# EAGLE design Relay_Controller_V1_0 (EAGLE 9.6.2)
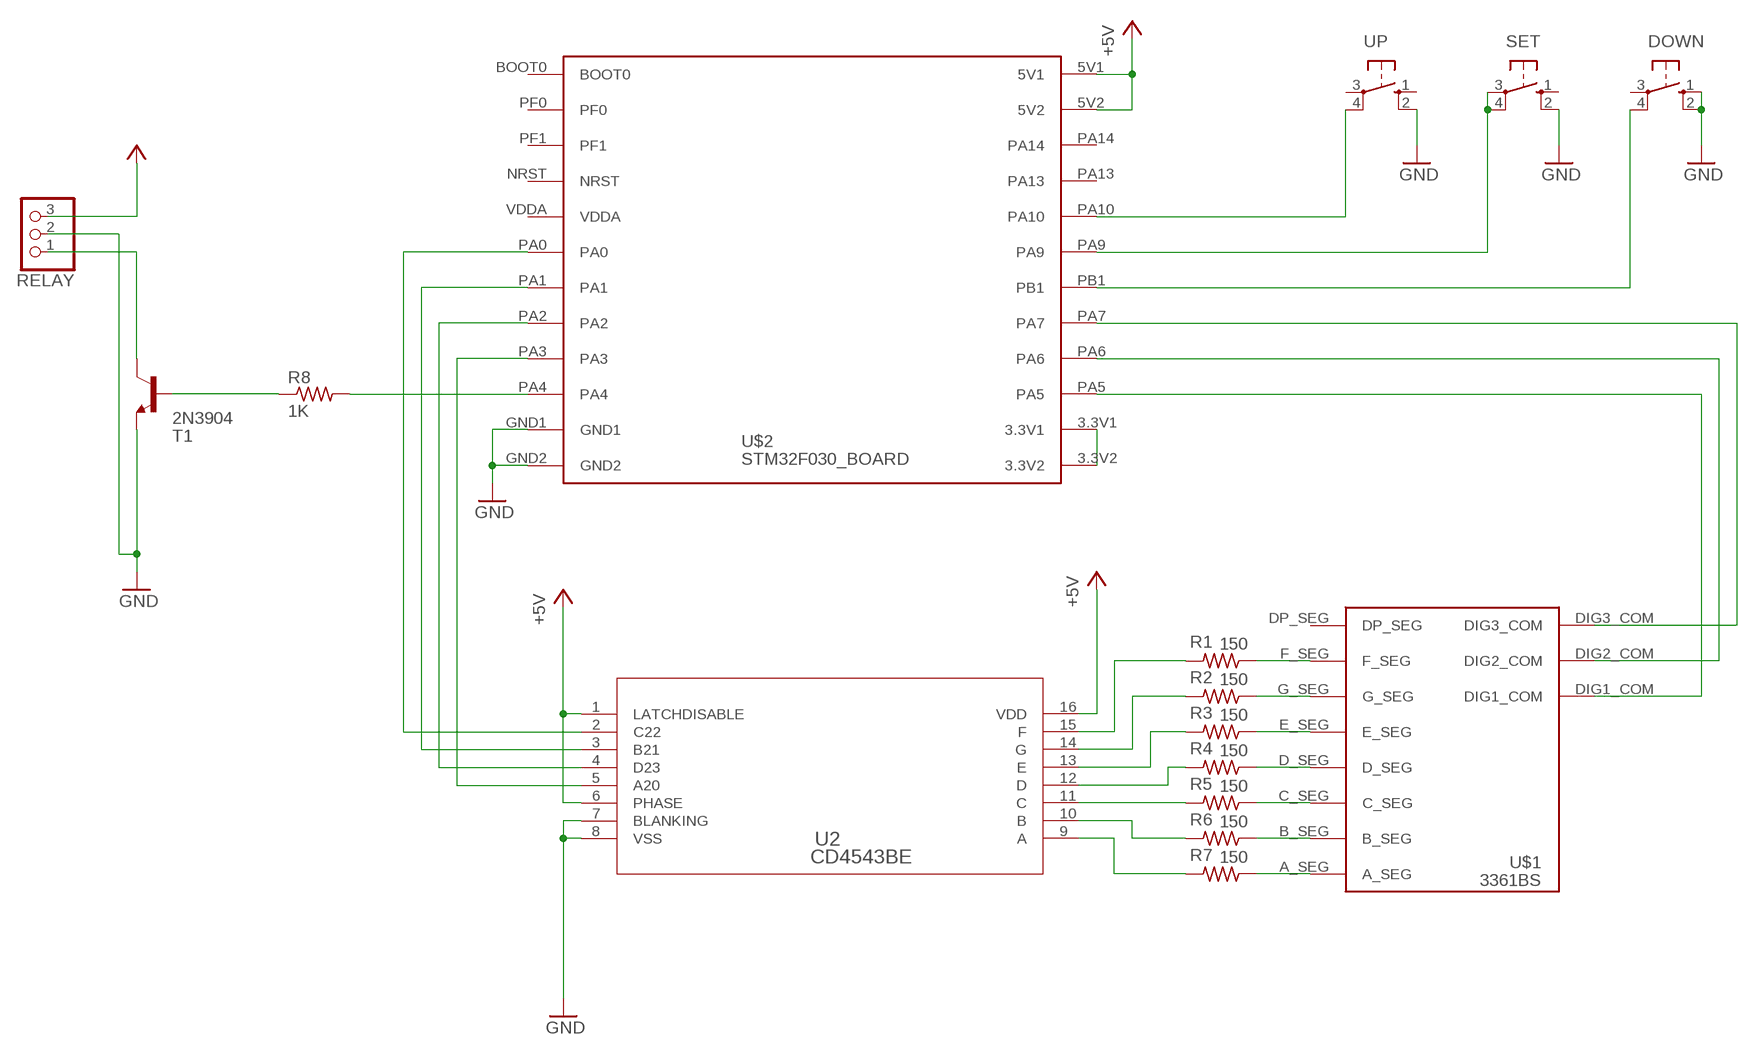
[diagram p0: schematic, sheet 1]

## Parts
DOWN  10-XX  [B3F-10XX]
R1  150  R-US_0207/7  [0207/7]
R2  150  R-US_0207/7  [0207/7]
R3  150  R-US_0207/7  [0207/7]
R4  150  R-US_0207/7  [0207/7]
R5  150  R-US_0207/7  [0207/7]
R6  150  R-US_0207/7  [0207/7]
R7  150  R-US_0207/7  [0207/7]
R8  1K  R-US_0207/7  [0207/7]
RELAY  PINHD-1X3  [1X03]
SET  10-XX  [B3F-10XX]
T1  2N3904  [TO92]
U2  CD4543BE  [N16]
U$1  3361BS  [3361BS]
U$2  STM32F030_BOARD  [STM32F030F4P6_BOARD]
UP  10-XX  [B3F-10XX]

## Nets
+5V: RELAY.3 U2.1(LATCHDISABLE) U2.6(PHASE) U2.16(VDD) U$2.5V1 U$2.5V2
GND: DOWN.1(S) DOWN.2(S1) RELAY.2 SET.2(S1) T1.3(E) U2.7(BLANKING) U2.8(VSS) U$2.GND1 U$2.GND2 UP.2(S1)
N$1: R1.1 U$1.F_SEG
N$2: R2.1 U$1.G_SEG
N$3: R3.1 U$1.E_SEG
N$4: R4.1 U$1.D_SEG
N$5: R5.1 U$1.C_SEG
N$6: R6.1 U$1.B_SEG
N$7: R7.1 U$1.A_SEG
N$8: R7.2 U2.9(A)
N$9: R6.2 U2.10(B)
N$10: R5.2 U2.11(C)
N$11: R1.2 U2.15(F)
N$12: R2.2 U2.14(G)
N$13: R3.2 U2.13(E)
N$14: R4.2 U2.12(D)
N$15: U2.2(C22) U$2.PA0
N$16: U2.3(B21) U$2.PA1
N$17: U2.4(D23) U$2.PA2
N$18: U2.5(A20) U$2.PA3
N$19: U$1.DIG1_COM U$2.PA5
N$20: U$1.DIG2_COM U$2.PA6
N$21: U$1.DIG3_COM U$2.PA7
N$22: U$2.3.3V1 U$2.3.3V2
N$23: DOWN.4(P1) U$2.PB1
N$24: R8.2 U$2.PA4
N$25: U$2.PA10 UP.4(P1)
N$26: RELAY.1 T1.1(C)
N$28: SET.3(P) SET.4(P1) U$2.PA9
N$29: R8.1 T1.2(B)
Unconnected: DOWN.3(P) SET.1(S) U$1.DP_SEG U$2.BOOT0 U$2.NRST U$2.PA13 U$2.PA14 U$2.PF0 U$2.PF1 U$2.VDDA UP.1(S) UP.3(P)

## Library data of the parts
DOWN SET UP = switch-omron:10-XX: OMRON SWITCH; MPN: B3F-1000; OC_FARNELL: 176432; OC_NEWARK: 36M3542
R1-R8 = rcl:R-US_: RESISTOR, American symbol; SPICEPREFIX: R
RELAY = pinhead:PINHD-1X3: PIN HEADER
T1 = transistor:2N3904: NPN TRANSISTOR
U2 = CD4543B_Seq:CD4543BE; DATASHEET_URL: http://www.ti.com/lit/gpn/CD4543B; DESCRIPTION: CMOS BCD-to-Seven-Segment Latch/Decoder/Driver for Liquid-Crystal Displays; FAMILY_NAME: DECODER/DEMULTIPLEXER; GENERIC_PART_NUMBER: CD4543B; INDUSTRY_STD_PKG_TYPE: PDIP; MANUFACTURER: Texas Instruments; PACKAGE_DESIGNATOR: N; PIN_COUNT: 16
U$1 = 3361BS:3361BS
U$2 = STM32F030_Board:STM32F030_BOARD

## Board
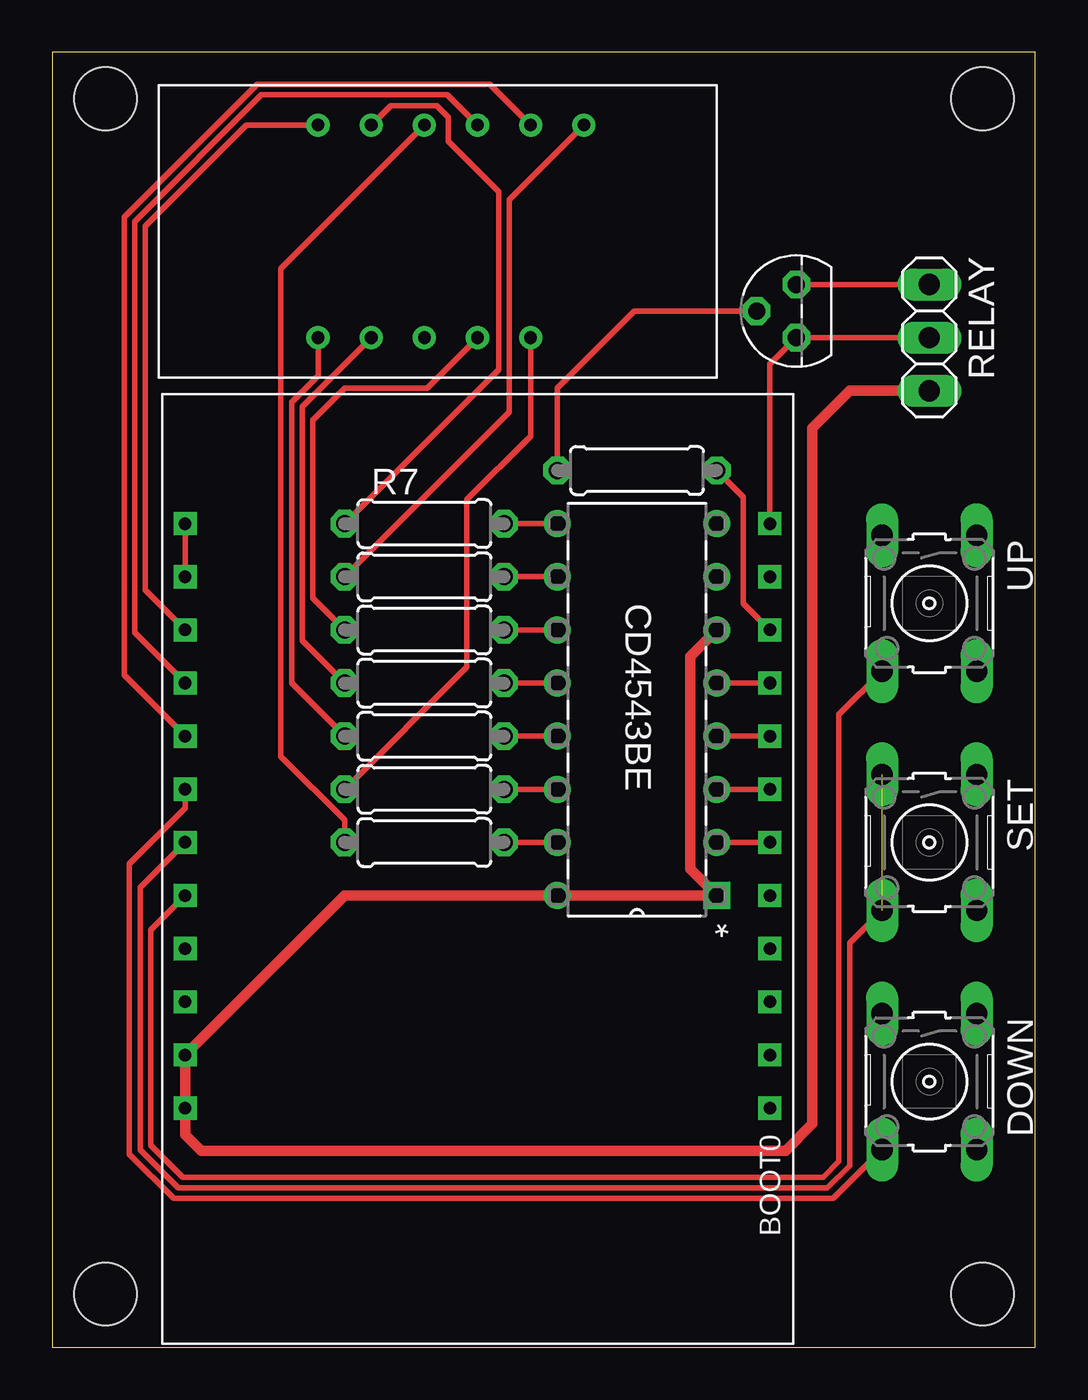
[diagram p1: board, top side]
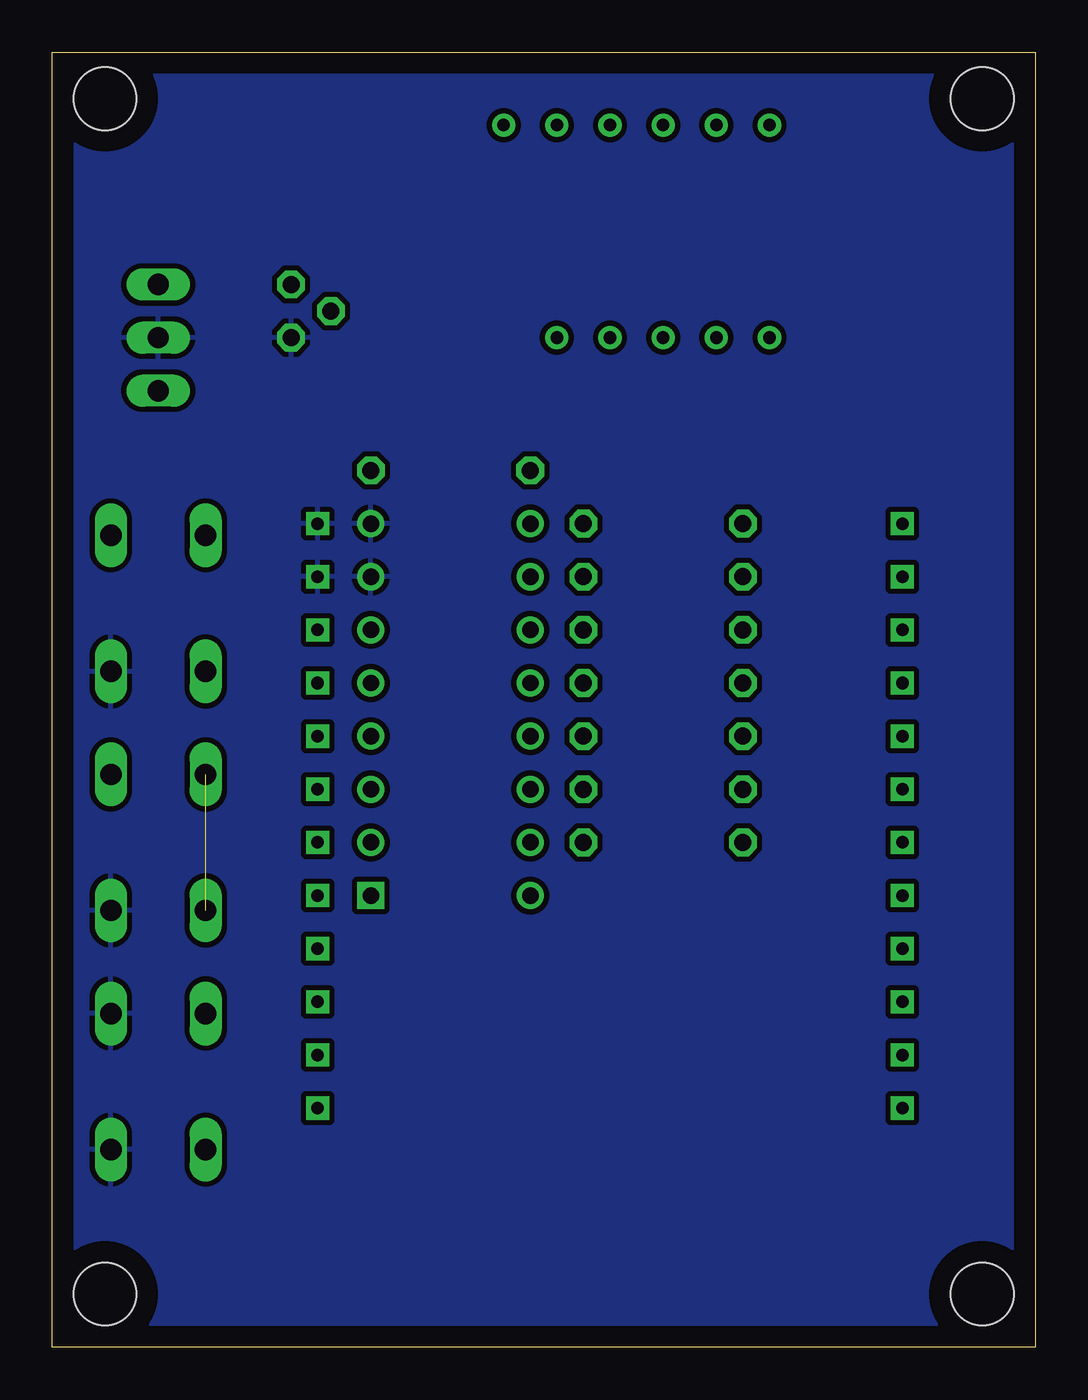
[diagram p2: board, bottom side, seen from below]

Size 46.97 x 61.9 mm. Coordinates in mm from the lower left corner, seen from the top.
Outline: 0,0 46.97,0 46.97,61.9 0,61.9 0,0
Copper layers (1*16): Top 0.035mm / dielectric 1.5mm / Bottom 0.035mm
Design rules "default *": minimum track width 10mil, minimum drill 0.35mm, track to track 10mil, track to pad 10mil, pad to pad 10mil, via to via 10mil, smd to smd 6mil, copper to edge 40mil, drill to drill 6mil, minimum pad ring 10mil, minimum via ring 8mil, stop-mask expansion 4mil, vias tented up to drill 0mil, thermal gap 10mil
Holes 3 mm at 2.54,59.69 2.54,2.54 44.45,59.69 44.45,2.54

### Footprints (pad centres in the part's own frame; a part is rotated, then mirrored left to right if it is on the bottom)
B3F-10XX = drill 1.016 long: 1 -3.251,2.261; 2 3.251,2.261; 3 -3.251,-2.261; 4 3.251,-2.261
0207/7 = drill 0.813 octagon: 1 -3.81,0; 2 3.81,0
1X03 = drill 1.016 long: 1 -2.54,0; 2 0,0; 3 2.54,0
TO92 = drill 0.813 octagon: 1 1.27,0; 2 0,1.905; 3 -1.27,0
N16 = drill 0.787 pad 1.295 square: 1 -7.62,17.78 | drill 0.787 pad 1.295: 2 -7.62,15.24; 3 -7.62,12.7; 4 -7.62,10.16; 5 -7.62,7.62; 6 -7.62,5.08; 7 -7.62,2.54; 8 -7.62,0; 9 0,0; 10 0,2.54; 11 0,5.08; 12 0,7.62; 13 0,10.16; 14 0,12.7; 15 0,15.24; 16 0,17.78
3361BS = drill 0.6: A_SEG -3.81,5.08; B_SEG 6.35,5.08; C_SEG 1.27,-5.08; D_SEG -3.81,-5.08; DIG1_COM -6.35,5.08; DIG2_COM 1.27,5.08; DIG3_COM 3.81,5.08; DP_SEG -1.27,-5.08; E_SEG -6.35,-5.08; F_SEG -1.27,5.08; G_SEG 3.81,-5.08
STM32F030F4P6_BOARD = drill 0.6 square: 3.3V1 29.21,-26.67; 3.3V2 29.21,-29.21; 5V1 29.21,-1.27; 5V2 29.21,-3.81; BOOT0 1.27,-1.27; GND1 1.27,-26.67; GND2 1.27,-29.21; NRST 1.27,-8.89; PA0 1.27,-13.97; PA1 1.27,-16.51; PA2 1.27,-19.05; PA3 1.27,-21.59; PA4 1.27,-24.13; PA5 29.21,-24.13; PA6 29.21,-21.59; PA7 29.21,-19.05; PA9 29.21,-13.97; PA10 29.21,-11.43; PA13 29.21,-8.89; PA14 29.21,-6.35; PB1 29.21,-16.51; PF0 1.27,-3.81; PF1 1.27,-6.35; VDDA 1.27,-11.43

### Placement (x,y rotation side)
DOWN  41.91,12.7 270 top
R1  17.78,24.13 0 top
R2  17.78,26.67 0 top
R3  17.78,29.21 0 top
R4  17.78,31.75 0 top
R5  17.78,34.29 0 top
R6  17.78,36.83 0 top
R7  17.78,39.37 0 top
R8  27.94,41.91 0 top
RELAY  41.91,48.26 270 top
SET  41.91,24.13 270 top
T1  35.56,49.53 90 top
U2  24.13,39.37 180 top
U$1  19.05,53.34 0 top
U$2  35.56,10.16 180 top
UP  41.91,35.56 270 top

### Tracks (layer width: path | path; a pad name or v marks a point on that pad's centre or on a via)
+5V
  Top 0.508: U2.6 30.48,33.02 30.48,22.86 U2.1 U2.16 13.97,21.59 U$2.5V2 U$2.5V1 6.35,10.16 7.11,9.4 35.05,9.4 36.32,10.67 36.32,43.94 38.1,45.72 RELAY.3
GND
  Top 0.254: U$2.GND2 34.29,46.99 T1.3 RELAY.2
  pour Bottom: -1.27,63.5 -1.27,-2.54 50.8,-2.54 50.8,63.5
N$1
  Top 0.254: R1.1 13.97,25.2 10.92,28.25 10.92,51.56 U$1.F_SEG
N$2
  Top 0.254: R2.1 19.81,32.51 19.81,40.51 22.86,43.56 U$1.G_SEG
N$3
  Top 0.254: U$1.E_SEG 12.7,46.44 11.43,45.17 11.43,31.75 R3.1
N$4
  Top 0.254: U$1.D_SEG 11.94,44.96 11.94,33.78 R4.1
N$5
  Top 0.254: U$1.C_SEG 17.91,45.85 13.97,45.85 12.45,44.32 12.45,35.81 R5.1
N$6
  Top 0.254: R6.1 21.84,44.7 21.84,54.86 U$1.B_SEG
N$7
  Top 0.254: R7.1 21.34,46.74 21.34,55.24 18.92,57.66 18.92,58.8 18.37,59.35 16.18,59.35 U$1.A_SEG
N$8
  Top 0.254: U2.9 R7.2
N$9
  Top 0.254: U2.10 R6.2
N$10
  Top 0.254: U2.11 R5.2
N$11
  Top 0.254: U2.15 R1.2
N$12
  Top 0.254: U2.14 R2.2
N$13
  Top 0.254: U2.13 R3.2
N$14
  Top 0.254: U2.12 R4.2
N$15
  Top 0.254: U$2.PA0 U2.2
N$16
  Top 0.254: U$2.PA1 U2.3
N$17
  Top 0.254: U$2.PA2 U2.4
N$18
  Top 0.254: U$2.PA3 U2.5
N$19
  Top 0.254: U$2.PA5 4.45,36.2 4.45,53.59 9.27,58.42 U$1.DIG1_COM
N$20
  Top 0.254: U$2.PA6 3.94,34.16 3.94,53.8 10,59.86 18.88,59.86 U$1.DIG2_COM
N$21
  Top 0.254: U$2.PA7 3.43,32.13 3.43,54.02 9.79,60.37 20.91,60.37 U$1.DIG3_COM
N$22
  Top 0.254: U$2.3.3V2 U$2.3.3V1
N$23
  Top 0.254: U$2.PB1 6.35,25.78 3.68,23.11 3.68,9.23 5.8,7.11 37.31,7.11 DOWN.4
N$24
  Top 0.254: R8.2 33.02,40.64 33.02,35.56 U$2.PA4
N$25
  Top 0.254: U$2.PA10 4.7,19.94 4.7,9.65 6.22,8.13 36.83,8.13 37.59,8.89 37.59,30.25 UP.4
N$26
  Top 0.254: T1.1 RELAY.1
N$28  (1 unrouted)
  Top 0.254: U$2.PA9 4.19,21.97 4.19,9.44 6.01,7.62 37.04,7.62 38.1,8.68 38.1,19.33 SET.4
N$29
  Top 0.254: R8.1 24.13,45.85 27.81,49.53 T1.2